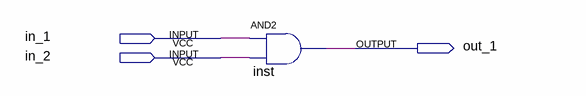
[diagram p0: schematic sheet]
// Quartus schematic test.bdf as structural Verilog: 1 symbols, 3 pins
module test (
  input  in_1,
  input  in_2,
  output out_1
);

  and inst (out_1, in_1, in_2);
endmodule
